# Altium schematic sheet accesory.SchDoc
size A4; SPICEModelCacheWUDVNOOA: <root> / <DocumentId>WUDVNOOA</DocumentId> / </root>
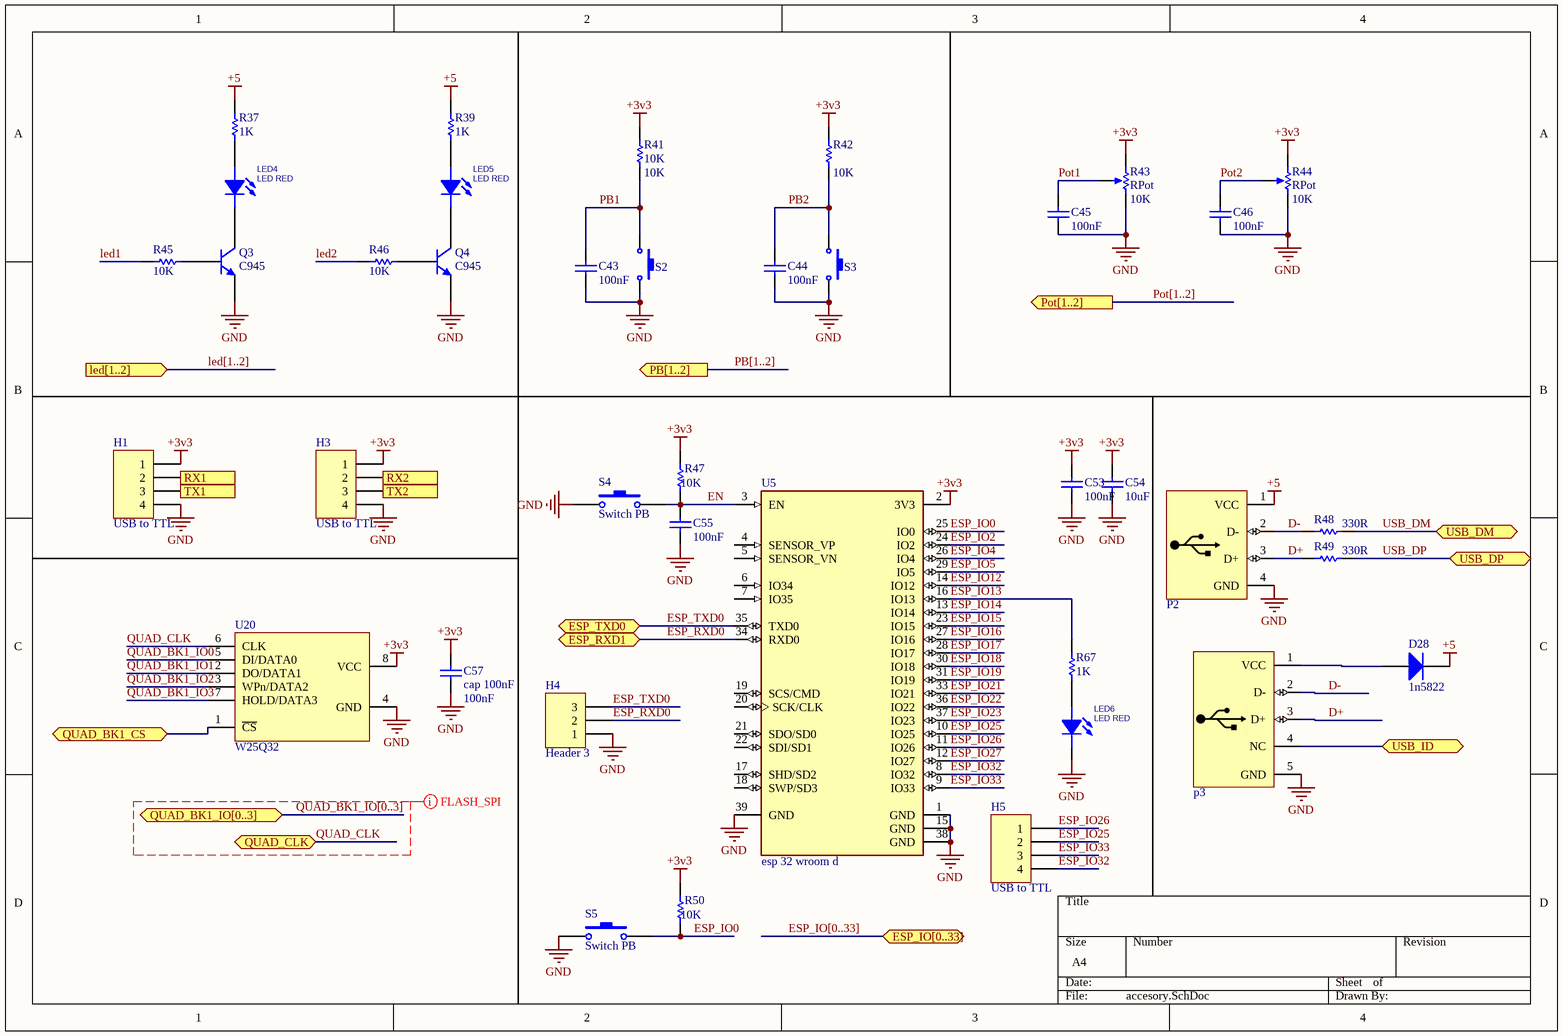
[diagram p0: accesory.SchDoc]

## Parts
C43  100nF  [SMD_CAP_0805]
C44  100nF  [SMD_CAP_0805]
C45  100nF  [SMD_CAP_0805]
C46  100nF  [SMD_CAP_0805]
C53  100nF  [CAP0805]
C54  10uF  [CAP0805]
C55  100nF  [CAP0805]
C57  cap 100nF  value 100nF  [Cap 805]
D28  1n5822  [DO214AC SMA]
H1  USB to TTL  [HDR1X4]
H3  USB to TTL  [HDR1X4]
H4  Header 3  [HDR1X3]
H5  USB to TTL  [HDR1X4]
LED4  LED RED  [led_0805]
LED5  LED RED  [led_0805]
LED6  LED RED  [led_0805]
P2  USB Connector  [USB2.5-2H4C]  (value not drawn)
p3  USB Connector  [USB_AB_BM_SHS]  (value not drawn)
Q3  C945  [SOT23_N]
Q4  C945  [SOT23_N]
R37  1K  [RES 0805 (2012X06L)]
R39  1K  [RES 0805 (2012X06L)]
R41  10K  [RES 0805 (2012X06L)]
R42  10K  [RES 0805 (2012X06L)]
R43  RPot  value 10K  [Multi Turn 02]
R44  RPot  value 10K  [Multi Turn 02]
R45  10K  [RES 0805 (2012X06L)]
R46  10K  [RES 0805 (2012X06L)]
R47  10K  [RES0805]
R48  330R  [RES 0805 (2012X06L)]
R49  330R  [RES 0805 (2012X06L)]
R50  10K  [RES0805]
R67  1K  [RES 0805 (2012X06L)]
S2  Switch PB  [Switch - Push to On]  (value not drawn)
S3  Switch PB  [Switch - Push to On]  (value not drawn)
S4  Switch PB  [Switch - Push to On]
S5  Switch PB  [Switch - Push to On]
U5  esp 32 wroom d  [esp-wroom]
U20  W25Q32  [WSON-8x6]

## Ports
ESP_IO[0..33] (bidir), ESP_RXD1 (bidir), ESP_TXD0 (bidir), led[1..2] (in), PB[1..2] (out), Pot[1..2] (out), QUAD_BK1_CS (bidir), QUAD_BK1_IO[0..3] (bidir), QUAD_CLK (bidir), RX1 (out), RX2 (out), TX1 (in), TX2 (in), USB_DM (bidir), USB_DP (bidir), USB_ID (bidir)

## Nets
+3v3: C53.2 C54.2 C57.2 H1.1 H3.1 R41.1 R42.1 R43.1(TOP) R44.1(TOP) R47.1 R50.1 U5.2(3V3) U20.8(VCC)
+5: D28.2(K) P2.1(VCC) R37.2 R39.2
GND: C43.1 C44.1 C45.1 C46.1 C53.1 C54.1 C55.1 C57.1 H1.4 H3.4 H4.1 LED6.2(CATHODE) P2.4(GND) p3.5(GND) Q3.2(E) Q4.2(E) R43.2(BOT) R44.2(BOT) S2.2 S3.2 S4.1 S5.1 U5.1(GND) U5.15(GND) U5.38(GND) U5.39(GND) U20.4(GND)
D+: P2.3(D+) p3.3(D+) R49.1
D-: P2.2(D-) p3.2(D-) R48.1
EN: C55.2 R47.2 S4.2 U5.3(EN)
ESP_IO0: R50.2 S5.2 U5.25(IO0)
ESP_IO2: U5.24(IO2)
ESP_IO4: U5.26(IO4)
ESP_IO5: U5.29(IO5)
ESP_IO12: U5.14(IO12)
ESP_IO13: R67.2 U5.16(IO13)
ESP_IO14: U5.13(IO14)
ESP_IO15: U5.23(IO15)
ESP_IO16: U5.27(IO16)
ESP_IO17: U5.28(IO17)
ESP_IO18: U5.30(IO18)
ESP_IO19: U5.31(IO19)
ESP_IO21: U5.33(IO21)
ESP_IO22: U5.36(IO22)
ESP_IO23: U5.37(IO23)
ESP_IO25: H5.2 U5.10(IO25)
ESP_IO26: H5.1 U5.11(IO26)
ESP_IO27: U5.12(IO27)
ESP_IO32: H5.4 U5.8(IO32)
ESP_IO33: H5.3 U5.9(IO33)
ESP_RXD0: H4.2 U5.34(RXD0) ; port ESP_RXD1
ESP_TXD0: H4.3 U5.35(TXD0) ; port ESP_TXD0
led1: R45.1
led2: R46.1
PB1: C43.2 R41.2 S2.1
PB2: C44.2 R42.2 S3.1
Pot1: C45.2 R43.3(TAP)
Pot2: C46.2 R44.3(TAP)
QUAD_BK1_CS: U20.1(~{CS}) ; port QUAD_BK1_CS
QUAD_BK1_IO0: U20.5(DI/DATA0)
QUAD_BK1_IO1: U20.2(DO/DATA1)
QUAD_BK1_IO2: U20.3(WPn/DATA2)
QUAD_BK1_IO3: U20.7(HOLD/DATA3)
QUAD_CLK: U20.6(CLK) ; port QUAD_CLK
RX1: H1.2 ; port RX1
RX2: H3.2 ; port RX2
TX1: H1.3 ; port TX1
TX2: H3.3 ; port TX2
USB_DM: R48.2 ; port USB_DM
USB_DP: R49.2 ; port USB_DP
USB_ID: p3.4(NC) ; port USB_ID
NetD28_1: D28.1(A) p3.1(VCC)
NetLED4_1: LED4.1(ANODE) R37.1
NetLED4_2: LED4.2(CATHODE) Q3.3(C)
NetLED5_1: LED5.1(ANODE) R39.1
NetLED5_2: LED5.2(CATHODE) Q4.3(C)
NetLED6_1: LED6.1(ANODE) R67.1
NetQ3_1: Q3.1(B) R45.2
NetQ4_1: Q4.1(B) R46.2

Not connected (* = marked no-connect by the designer): U5 4(SENSOR_VP) 5(SENSOR_VN) 6(IO34) 7(IO35) 17(SHD/SD2) 18(SWP/SD3) 19(SCS/CMD) 20(SCK/CLK) 21(SDO/SD0) 22(SDI/SD1)

## Buses and harness runs
bus ESP_IO[0..33] = port ESP_IO[0..33]
bus led[1..2] = port led[1..2]
bus PB[1..2] = port PB[1..2]
bus Pot[1..2] = port Pot[1..2]
bus QUAD_BK1_IO[0..3] = port QUAD_BK1_IO[0..3]

## Layout directives
net class FLASH_SPI: QUAD_BK1_IO[0..3], QUAD_CLK

## Library data of the parts
C43-C46 C57 = Cap: Capacitor; Published: 8-Jun-2000; LatestRevisionDate: 17-Jul-2002; LatestRevisionNote: Re-released for DXP Platform.; PackageReference: RAD-0.3; Publisher: Altium Limited; PackageDescription: Radial Cap, Thru-Hole; 2 Leads; 0.3 in Pin Spacing
  C43-C46: Value: 100nF
C53-C55 = Cap: CAP SMD 0805; Published: 8-Jun-2000; LatestRevisionDate: 17-Jul-2002; LatestRevisionNote: Re-released for DXP Platform.; PackageReference: RAD-0.3; Publisher: Altium Limited; PackageDescription: Radial Cap, Thru-Hole; 2 Leads; 0.3 in Pin Spacing
  C53 C55: Value: 100nF
  C54: Value: 10uF
D28 = Diode 1N4007: 1 Amp General Purpose Rectifier; Published: 8-Jun-2000; LatestRevisionDate: 17-Jul-2002; LatestRevisionNote: Re-released for DXP Platform.; DatasheetVersion: 1998; PackageVersion: Aug-1999; PackageReference: DO-41; Publisher: Altium Limited; PackageDescription: Diode, Axial; Body 5.2 x 2.7 mm (LxDia. max), Lead Dia. 0.86 mm (max); Code_JEDEC: DO-204-AL; ComponentLink1Description: Manufacturer Link; ComponentLink1URL: http://www.fairchildsemi.com/; ComponentLink2Description: Datasheet; ComponentLink2URL: http://www.fairchildsemi.com/ds/1N%2F1N4001.pdf
H1 H3 H5 = H-1x4
H4 = Header 3: Header, 3-Pin; LatestRevisionDate: 17-Jul-2002; LatestRevisionNote: Re-released for DXP Platform.; Publisher: Altium Limited
LED4-LED6 = LED 5MM: Light Emitting Diode; Designer: Abbas Basereh; Data: 16-12-2016; Link: *; Part.No: *
P2 = USB A-Type: USB Connector-A Type
p3 = USB MICRO: USB Connector MICRO-B Type; Designer: ABBAS BASEREH; Max Current: 1600mA; Mounting Technology: Surface Mount\Through-Hole; Category: Connector; Pin Count: 5-7; Publisher: ABBAS BASEREH; Status: Unreleased; ComponentLink1Description: Datasheet; ComponentLink2Description: Reference; Update: 1395-11-17
Q3 Q4 = C945: NPN Silicon Epitaxial Planar Transistor; Published: 2017-2-8; LatestRevisionDate: 2017; LatestRevisionNote: IPC-7351 Footprint Added.; DatasheetVersion: 2017; PackageVersion: 2017-2-8; PackageReference: SOT23; Publisher: Abbas Basereh; PackageDescription: 3-Pin SOT-23 Package 0.95 mm Pitch, 2.3 mm Lead Span; ComponentLink1Description: Manufacturer Link; ComponentLink1URL: http://www.taitroncomponents.com/; ComponentLink2Description: Datasheet; ComponentLink2URL: http://www.taitroncomponents.com/
R37 R39 R67 = RES Axial 0.25W: Designer: Abbas Basereh; Desc.: RES Axial 0.25W; Data: 4-1-2017
R41 R42 R45-R50 = Res1: Resistor; Published: 8-Jun-2000; LatestRevisionDate: 17-Jul-2002; LatestRevisionNote: Re-released for DXP Platform.; PackageReference: AXIAL-0.3; Publisher: Altium Limited; PackageDescription: Axial Device, Thru-Hole; 2 Leads; 0.3 in Pin Spacing
  R41 R42 R45-R47 R50: Value: 10K
  R48 R49: Value: 330R
R43 R44 = RPot: Potentiometer; Sim Note: Enter the Resistance value and the set point into parameter fields.; Set Position: 0.5; Published: 8-Jun-2000; LatestRevisionDate: 17-Jul-2002; LatestRevisionNote: Re-released for DXP Platform.; PackageReference: VR5; Publisher: Altium Limited; PackageDescription: Variable Resistor, Thru-Hole; 3 Leads
S2-S5 = Switch PB: Push Button Switch
U5 = ESP32-wroom
U20 = W25Q32: NOR flash